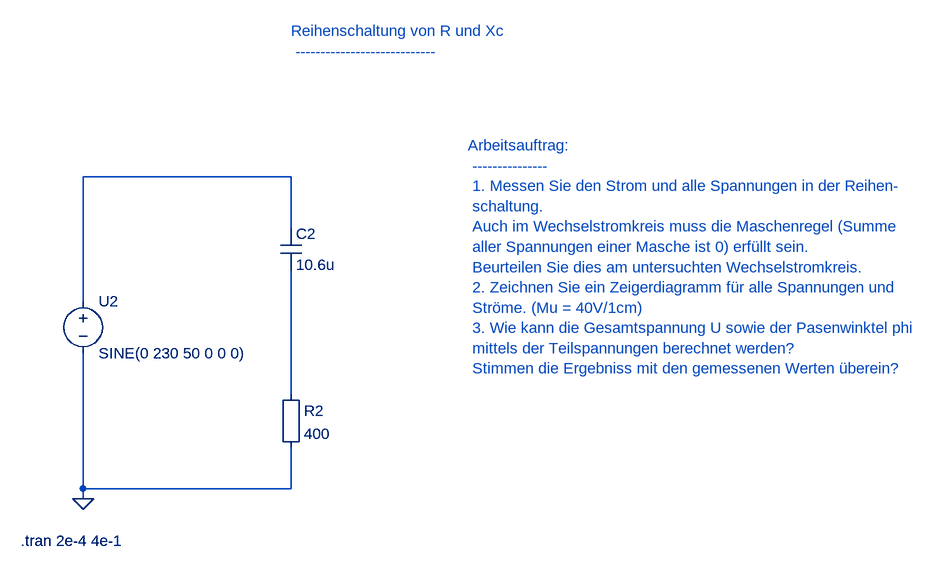
[diagram p0: schematic 13_1_Reihenschaltung von R und Xc.asc]
13_1_Reihenschaltung von R und Xc.asc, the LTspice schematic file:
Version 4
SHEET 1 880 680
WIRE 160 560 160 576
WIRE 480 432 480 448
WIRE 160 576 160 768
WIRE 160 768 160 784
WIRE 480 704 480 768
WIRE 480 768 160 768
WIRE 160 480 160 288
WIRE 160 288 480 288
WIRE 480 288 480 368
WIRE 480 448 480 624
FLAG 160 784 0
SYMBOL voltage 160 464 R0
SYMATTR InstName U2
SYMATTR Value SINE(0 230 50 0 0 0)
SYMBOL Misc\EuropeanResistor 464 608 R0
SYMATTR InstName R2
SYMATTR Value 400
SYMBOL cap 464 368 R0
SYMATTR InstName C2
SYMATTR Value 10.6u
TEXT 64 848 Left 2 !.tran 2e-4 4e-1
TEXT 480 64 Left 2 ;Reihenschaltung von R und Xc \n ----------------------------
TEXT 752 240 Left 2 ;Arbeitsauftrag: \n --------------- \n 1. Messen Sie den Strom und alle Spannungen in der Reihen- \n schaltung. \n Auch im Wechselstromkreis muss die Maschenregel (Summe \n aller Spannungen einer Masche ist 0) erfüllt sein. \n Beurteilen Sie dies am untersuchten Wechselstromkreis. \n 2. Zeichnen Sie ein Zeigerdiagramm für alle Spannungen und \n Ströme. (Mu = 40V/1cm) \n 3. Wie kann die Gesamtspannung U sowie der Pasenwinktel phi \n mittels der Teilspannungen berechnet werden? \n Stimmen die Ergebniss mit den gemessenen Werten überein?

The netlist it stands for:
* 13_1_Reihenschaltung von R und Xc.asc
V§U2 N002 0 SINE(0 230 50 0 0 0)
R2 N001 0 400
C2 N002 N001 10.6u
.tran 2e-4 4e-1
* Reihenschaltung von R und Xc
*  ----------------------------
* Arbeitsauftrag:
*  ---------------
*  1. Messen Sie den Strom und alle Spannungen in der Reihen-
*  schaltung.
*  Auch im Wechselstromkreis muss die Maschenregel (Summe
*  aller Spannungen einer Masche ist 0) erfüllt sein.
*  Beurteilen Sie dies am untersuchten Wechselstromkreis.
*  2. Zeichnen Sie ein Zeigerdiagramm für alle Spannungen und
*  Ströme. (Mu = 40V/1cm)
*  3. Wie kann die Gesamtspannung U sowie der Pasenwinktel phi
*  mittels der Teilspannungen berechnet werden?
*  Stimmen die Ergebniss mit den gemessenen Werten überein?
.backanno
.end